# EAGLE design control (EAGLE 6.2)
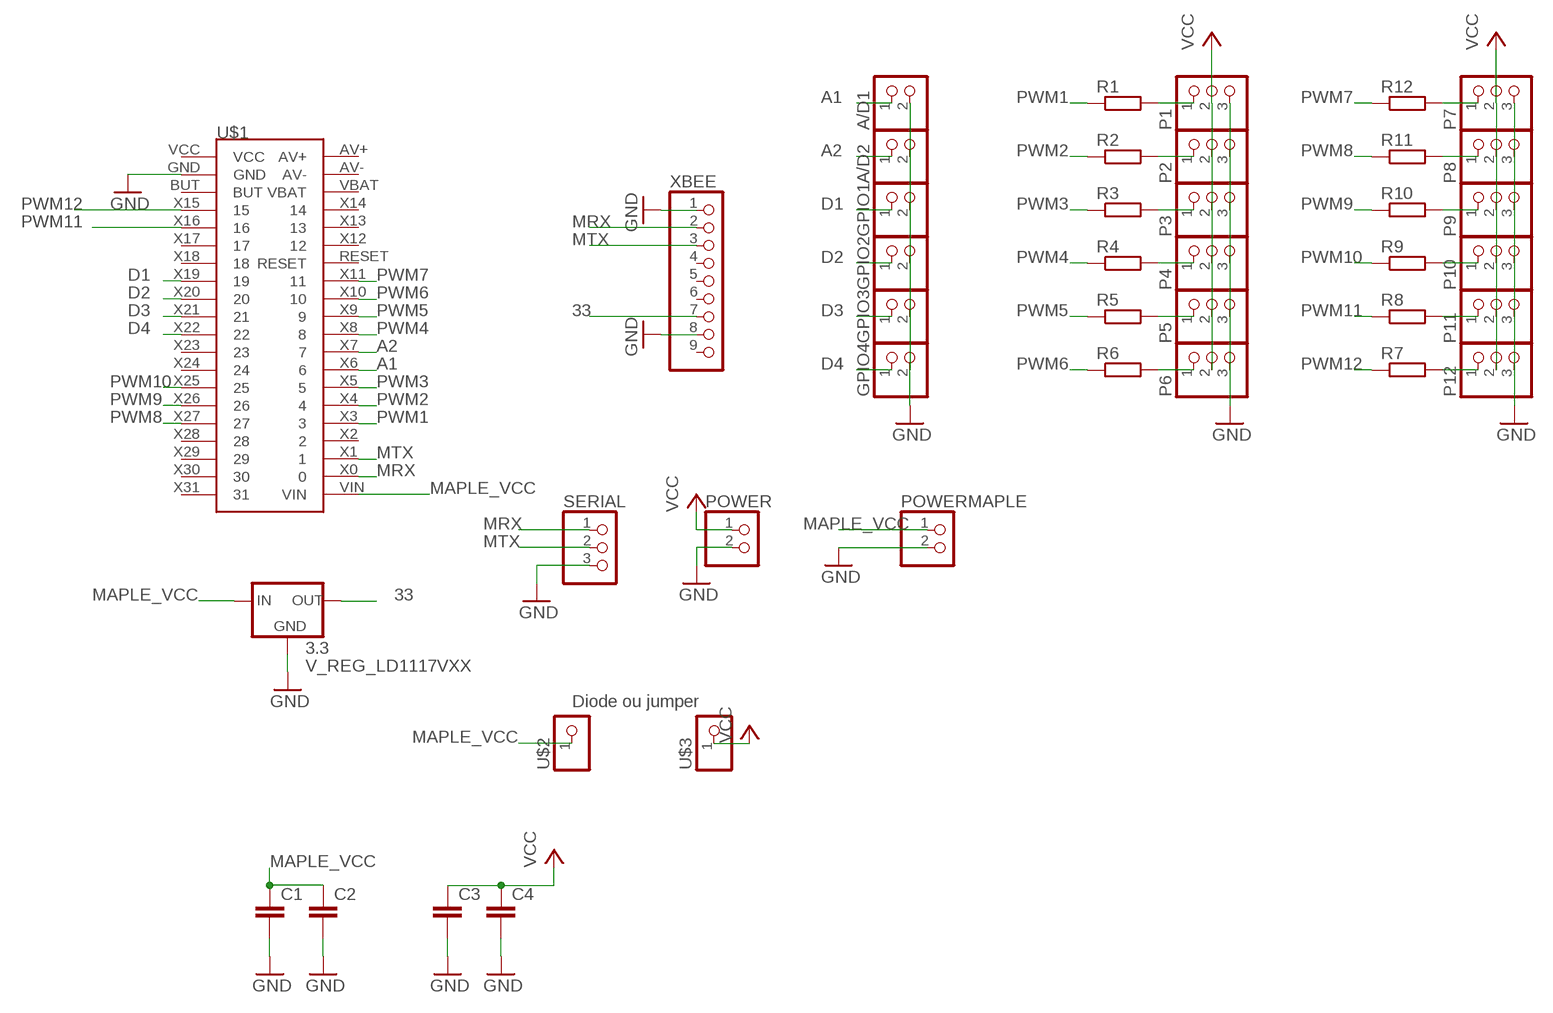
[diagram p0: schematic, sheet 1]

## Parts
3.3  V_REG_LD1117VXX  [78XXL]
A/D1  CONNEC_1X02  [CONNEC_1X02]
A/D2  CONNEC_1X02  [CONNEC_1X02]
C1  C-EU075-032X103  [C075-032X103]
C2  C-EU075-032X103  [C075-032X103]
C3  C-EU075-032X103  [C075-032X103]
C4  C-EU075-032X103  [C075-032X103]
GPIO1  CONNEC_1X02  [CONNEC_1X02]
GPIO2  CONNEC_1X02  [CONNEC_1X02]
GPIO3  CONNEC_1X02  [CONNEC_1X02]
GPIO4  CONNEC_1X02  [CONNEC_1X02]
P1  CONNEC_1X03  [CONNEC_1X03]
P2  CONNEC_1X03  [CONNEC_1X03]
P3  CONNEC_1X03  [CONNEC_1X03]
P4  CONNEC_1X03  [CONNEC_1X03]
P5  CONNEC_1X03  [CONNEC_1X03]
P6  CONNEC_1X03  [CONNEC_1X03]
P7  CONNEC_1X03  [CONNEC_1X03]
P8  CONNEC_1X03  [CONNEC_1X03]
P9  CONNEC_1X03  [CONNEC_1X03]
P10  CONNEC_1X03  [CONNEC_1X03]
P11  CONNEC_1X03  [CONNEC_1X03]
P12  CONNEC_1X03  [CONNEC_1X03]
POWER  CONNEC_1X02  [CONNEC_1X02]
POWERMAPLE  CONNEC_1X02  [CONNEC_1X02]
R1  RESISTANCE-R0805  [R0805]
R2  RESISTANCE-R0805  [R0805]
R3  RESISTANCE-R0805  [R0805]
R4  RESISTANCE-R0805  [R0805]
R5  RESISTANCE-R0805  [R0805]
R6  RESISTANCE-R0805  [R0805]
R7  RESISTANCE-R0805  [R0805]
R8  RESISTANCE-R0805  [R0805]
R9  RESISTANCE-R0805  [R0805]
R10  RESISTANCE-R0805  [R0805]
R11  RESISTANCE-R0805  [R0805]
R12  RESISTANCE-R0805  [R0805]
SERIAL  CONNEC_1X03  [CONNEC_1X03]
U$1  MAPLE_MINI  [CONNEC_2X20]
U$2  CONNEC_1X01  [CONNEC_1X01]
U$3  CONNEC_1X01  [CONNEC_1X01]
XBEE  CONNEC_1X09  [CONNEC_1X09]

## Nets
33: 3.3.GND(OUT) XBEE.7
A1: A/D1.1 U$1.X6
A2: A/D2.1 U$1.X7
D1: GPIO1.1 U$1.X19
D2: GPIO2.1 U$1.X20
D3: GPIO3.1 U$1.X21
D4: GPIO4.1 U$1.X22
GND [alime]: 3.3.IN(GND) A/D1.2 A/D2.2 C1.2 C2.2 C3.2 C4.2 GPIO1.2 GPIO2.2 GPIO3.2 GPIO4.2 P1.3 P2.3 P3.3 P4.3 P5.3 P6.3 P7.3 P8.3 P9.3 P10.3 P11.3 P12.3 POWER.2 POWERMAPLE.2 SERIAL.3 U$1.GND XBEE.1 XBEE.8
MAPLE_VCC: 3.3.OUT(IN) C1.1 C2.1 POWERMAPLE.1 U$1.VIN U$2.1
MRX: SERIAL.1 U$1.X0 XBEE.2
MTX: SERIAL.2 U$1.X1 XBEE.3
N$1: P1.1 R1.2
N$2: P2.1 R2.2
N$3: P3.1 R3.2
N$4: P4.1 R4.2
N$5: P5.1 R5.2
N$6: P6.1 R6.2
N$7: P12.1 R7.2
N$8: P11.1 R8.2
N$9: P10.1 R9.2
N$10: P9.1 R10.2
N$11: P8.1 R11.2
N$12: P7.1 R12.2
PWM1: R1.1 U$1.X3
PWM2: R2.1 U$1.X4
PWM3: R3.1 U$1.X5
PWM4: R4.1 U$1.X8
PWM5: R5.1 U$1.X9
PWM6: R6.1 U$1.X10
PWM7: R12.1 U$1.X11
PWM8: R11.1 U$1.X27
PWM9: R10.1 U$1.X26
PWM10: R9.1 U$1.X25
PWM11: R8.1 U$1.X16
PWM12: R7.1 U$1.X15
VCC [alime]: C3.1 C4.1 P1.2 P2.2 P3.2 P4.2 P5.2 P6.2 P7.2 P8.2 P9.2 P10.2 P11.2 P12.2 POWER.1 U$3.1
Unconnected: U$1.AV+ U$1.AV- U$1.BUT U$1.RESET U$1.VBAT U$1.VCC U$1.X2 U$1.X12 U$1.X13 U$1.X14 U$1.X17 U$1.X18 U$1.X23 U$1.X24 U$1.X28 U$1.X29 U$1.X30 U$1.X31 XBEE.4 XBEE.5 XBEE.6 XBEE.9

## Notes on the sheet
- Diode ou jumper

## Library data of the parts
3.3 = SparkFun-PowerIC:V_REG_LD1117VXX: LD1117VXX voltage regulator. We carry the 3.3V version (COM-00526) in TO-220 package.
A/D1 A/D2 GPIO1-GPIO4 POWER POWERMAPLE = rhoban:CONNEC_1X02
C1-C4 = rcl:C-EU: CAPACITOR, European symbol
P1-P12 SERIAL = rhoban:CONNEC_1X03
R1-R12 = rhoban:RESISTANCE: RESISTOR, European symbol
U$1 = rhoban:MAPLE_MINI
U$2 U$3 = rhoban:CONNEC_1X01
XBEE = rhoban:CONNEC_1X09

## Net classes
1 alime: width 1.016 mm

## Board
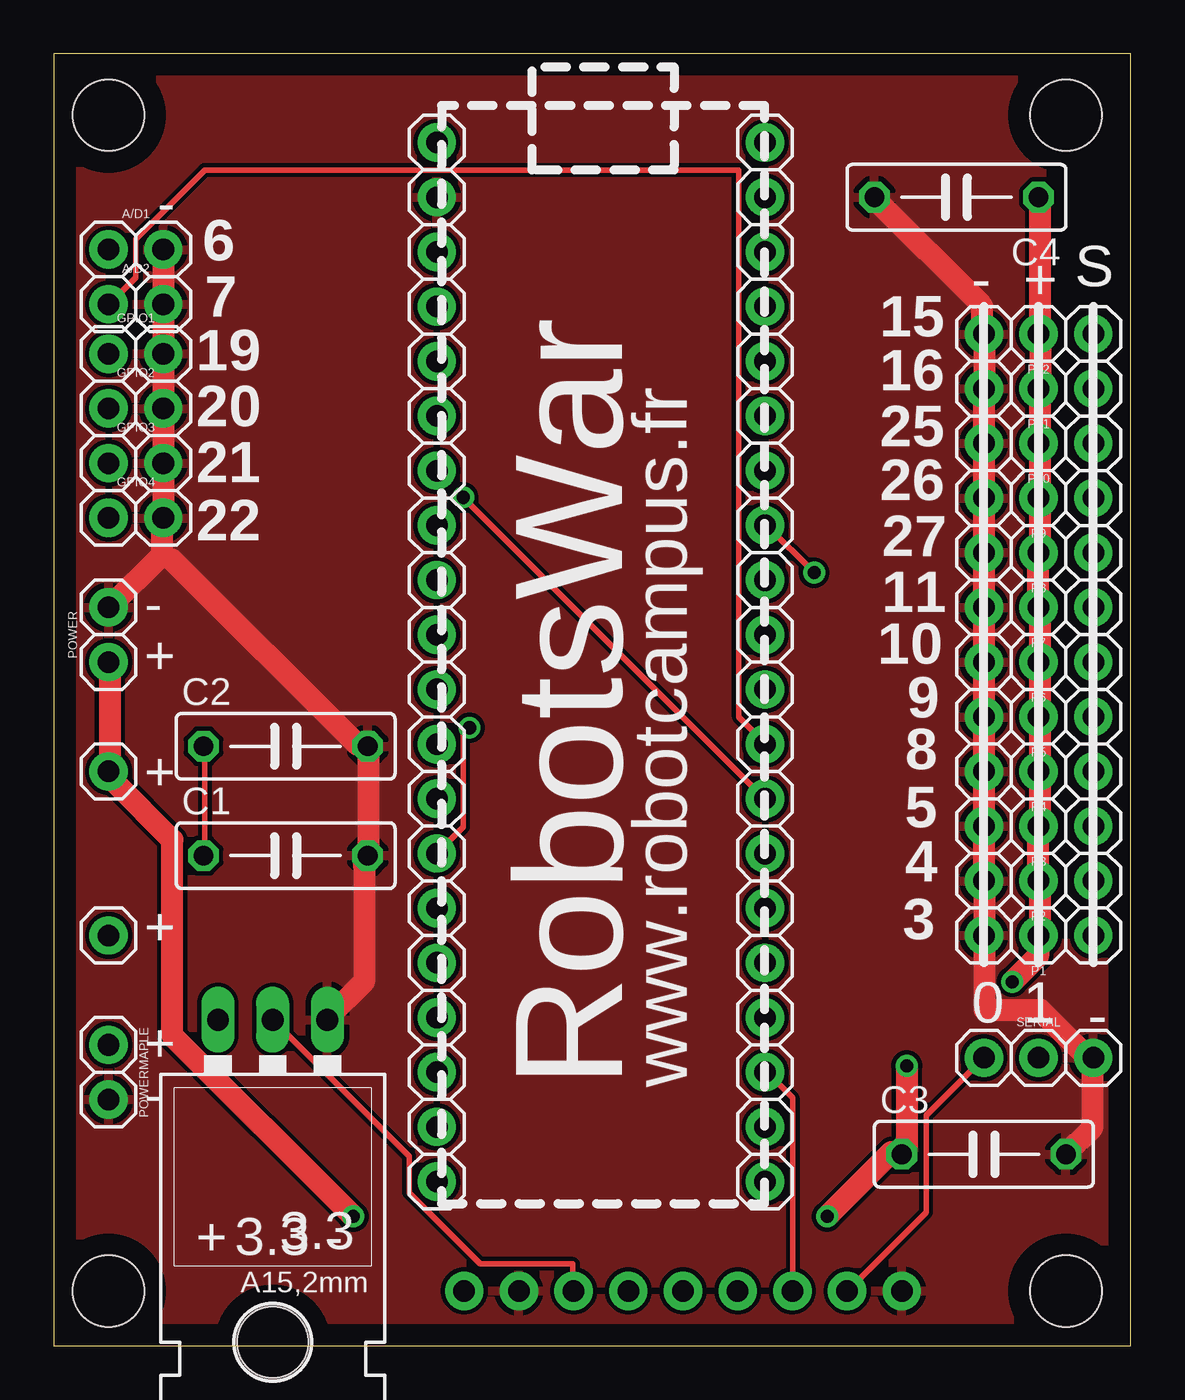
[diagram p1: board, top side]
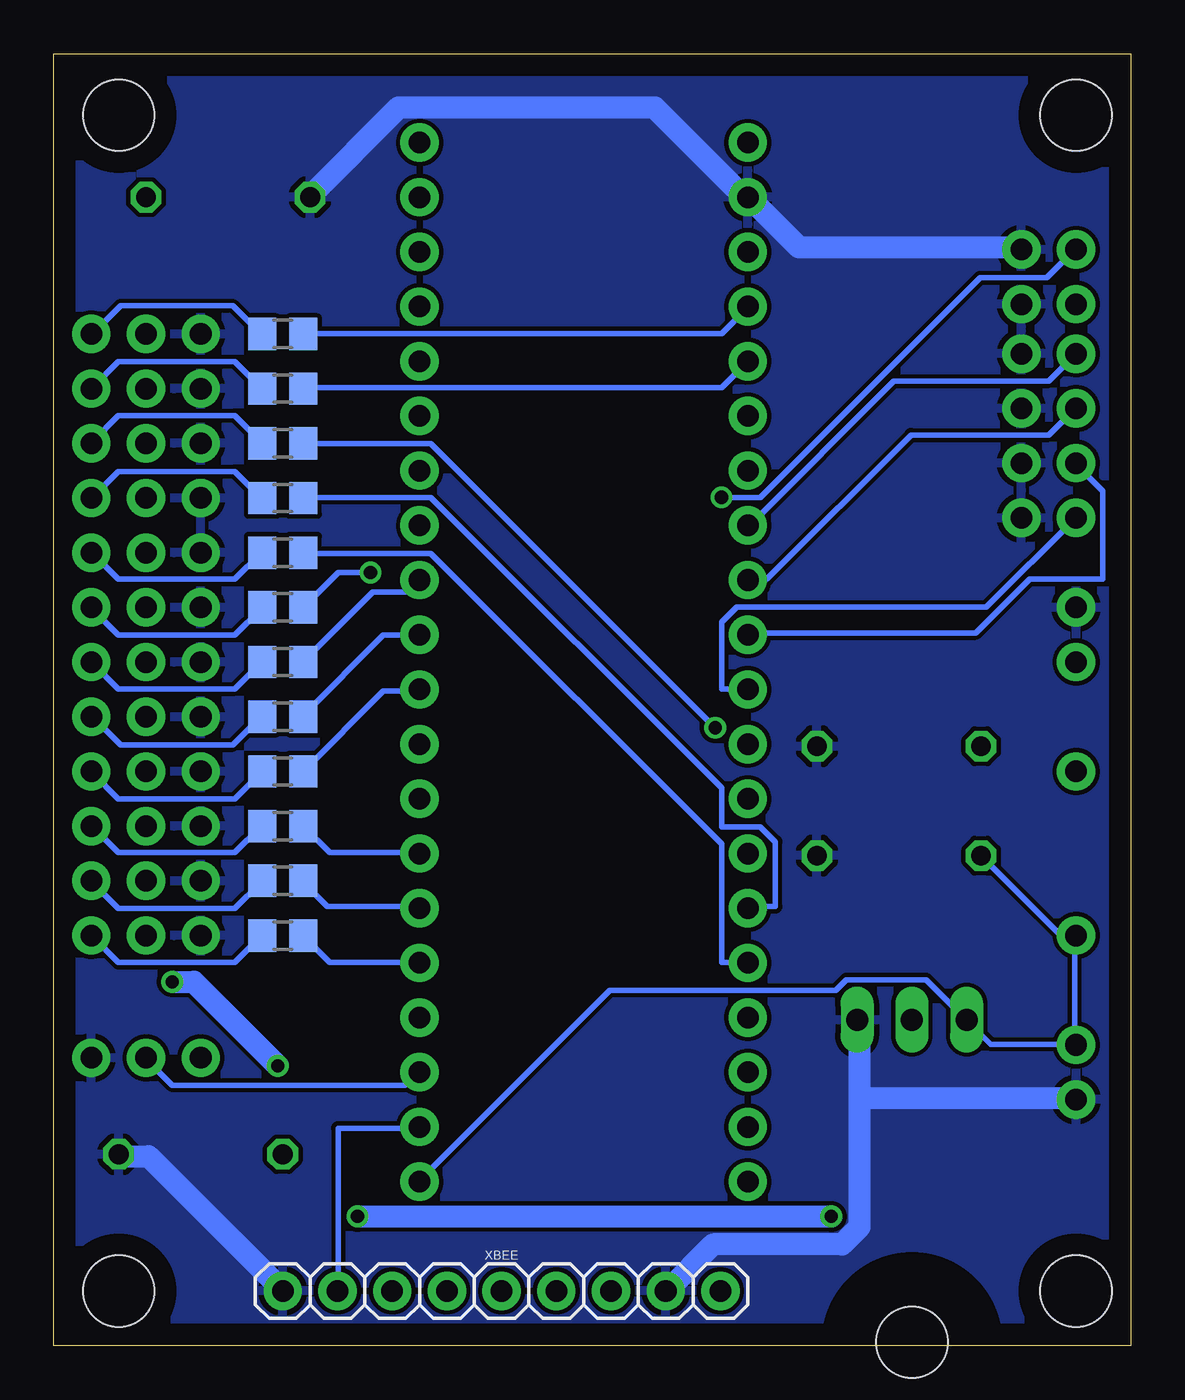
[diagram p2: board, bottom side, seen from below]

Size 50 x 60 mm. Coordinates in mm from the lower left corner, seen from the top.
Outline: 0,0 50,0 50,60 0,60 0,0
Copper layers (1*16): Top 0.035mm / dielectric 1.5mm / Bottom 0.035mm
Design rules: minimum track width 10mil, minimum drill 24mil, track to track 8mil, track to pad 8mil, pad to pad 8mil, via to via 8mil, smd to smd 8mil, copper to edge 40mil, drill to drill 8mil, minimum pad ring 10mil, minimum via ring 8mil, stop-mask expansion 4mil, vias tented up to drill 0mil, thermal gap 10mil

### Footprints (pad centres in the part's own frame; a part is rotated, then mirrored left to right if it is on the bottom)
78XXL = drill 1.016 long: GND 0,-3.81; IN -2.54,-3.81; OUT 2.54,-3.81 | hole 3.302: 0,11.176
CONNEC_1X02 = drill 1 pad 1.778: 1 -1.27,1.27; 2 1.27,1.27
C075-032X103 = drill 0.914 octagon: 1 -3.81,0; 2 3.81,0
CONNEC_1X03 = drill 1 pad 1.778: 1 -1.27,1.27; 2 1.27,1.27; 3 3.81,1.27
R0805 = smd 1.3 x 1.5: 1 -0.95,0; 2 0.95,0
CONNEC_2X20 = drill 1 pad 1.778: AV+ 0,0; AV- 2.54,0; BUT 5.08,-15.24; GND 2.54,-15.24; RESET 15.24,0; VBAT 5.08,0; VCC 0,-15.24; VIN 48.26,0; X0 45.72,0; X1 43.18,0; X2 40.64,0; X3 38.1,0; X4 35.56,0; X5 33.02,0; X6 30.48,0; X7 27.94,0; X8 25.4,0; X9 22.86,0; X10 20.32,0; X11 17.78,0; X12 12.7,0; X13 10.16,0; X14 7.62,0; X15 7.62,-15.24; X16 10.16,-15.24; X17 12.7,-15.24; X18 15.24,-15.24; X19 17.78,-15.24; X20 20.32,-15.24; X21 22.86,-15.24; X22 25.4,-15.24; X23 27.94,-15.24; X24 30.48,-15.24; X25 33.02,-15.24; X26 35.56,-15.24; X27 38.1,-15.24; X28 40.64,-15.24; X29 43.18,-15.24; X30 45.72,-15.24; X31 48.26,-15.24
CONNEC_1X01 = drill 1 pad 1.778: 1 0,0
STAND-OFF = hole 3.302: 0,0
CONNEC_1X09 = drill 1 pad 1.778: 1 -1.27,1.27; 2 1.27,1.27; 3 3.81,1.27; 4 6.35,1.27; 5 8.89,1.27; 6 11.43,1.27; 7 13.97,1.27; 8 16.51,1.27; 9 19.05,1.27

### Placement (x,y rotation side)
3.3  10.16,11.33 180 top
A/D1  3.81,49.64 0 top
A/D2  3.81,47.1 0 top
C1  10.76,22.76 0 top
C2  10.76,27.84 0 top
C3  43.18,8.89 0 top
C4  41.91,53.34 180 top
GPIO1  3.81,44.8 0 top
GPIO2  3.81,42.26 0 top
GPIO3  3.81,39.72 0 top
GPIO4  3.81,37.18 0 top
P1  46.99,20.32 180 top
P2  46.99,22.86 180 top
P3  46.99,25.4 180 top
P4  46.99,27.94 180 top
P5  46.99,30.48 180 top
P6  46.99,33.02 180 top
P7  46.99,35.56 180 top
P8  46.99,38.1 180 top
P9  46.99,40.64 180 top
P10  46.99,43.18 180 top
P11  46.99,45.72 180 top
P12  46.99,48.26 180 top
POWER  3.81,33.02 90 top
POWERMAPLE  1.27,12.7 270 top
R1  39.37,19.05 180 bottom
R2  39.37,21.59 180 bottom
R3  39.37,24.13 180 bottom
R4  39.37,26.67 180 bottom
R5  39.37,29.21 180 bottom
R6  39.37,31.75 180 bottom
R7  39.37,46.99 180 bottom
R8  39.37,44.45 180 bottom
R9  39.37,41.91 180 bottom
R10  39.37,39.37 180 bottom
R11  39.37,36.83 180 bottom
R12  39.37,34.29 180 bottom
SERIAL  44.45,12.1 0 top
U$1  33.02,55.88 270 top
U$2  2.54,19.05 0 top
U$3  2.54,26.67 0 top
U$4  [STAND-OFF]  2.54,57.15 0 top
U$5  [STAND-OFF]  2.54,2.54 0 top
U$6  [STAND-OFF]  46.99,2.54 0 top
U$7  [STAND-OFF]  46.99,57.15 0 top
XBEE  38.1,1.27 0 bottom

### Tracks (layer width: path | path; a pad name or v marks a point on that pad's centre or on a via)
33
  Top 0.254: 3.3.GND 16.5,8.8 16.5,7.1 19.8,3.8 24.1,3.8 24.1,2.6 XBEE.7
A1  (via drill 0.61)
  Top 0.254: v19,39.4 33,25.4 U$1.X6
  Bottom 0.254: v19,39.4 17.2,39.4 7,49.6 3.9,49.6 2.6,50.9 A/D1.1
A2
  Top 0.254: A/D2.1 2.6,48.4 3.8,49.6 3.8,51.4 7,54.6 31.8,54.6 31.8,29.2 33,28 U$1.X7
D1
  Bottom 0.254: GPIO1.1 2.6,46 3.8,44.8 11,44.8 17.7,38.1 U$1.X19
D2
  Bottom 0.254: GPIO2.1 2.6,43.5 3.8,42.3 10.2,42.3 16.9,35.6 17.7,35.6 U$1.X20
D3
  Bottom 0.254: GPIO3.1 2.5,40.9 1.3,39.7 1.3,35.6 4.7,35.6 7.2,33.1 17.7,33.1 U$1.X21
D4
  Bottom 0.254: GPIO4.1 2.6,38.4 6.7,34.3 18.3,34.3 19,33.6 19,30.5 17.8,30.5 U$1.X22
GND
  Top 1.016: C3.2 48.2,10.1 48.2,13.3 SERIAL.3 47.8,13.6 45.8,15.6 43.2,15.6 43.2,18.6 P1.3 43.2,19.1 43.2,21.5 P2.3 43.2,22.1 43.2,24.1 P3.3 43.2,24.6 43.2,26.6 P4.3 43.2,27.2 43.2,29.2 P5.3 43.2,29.7 43.2,31.7 P6.3 43.2,32.2 43.2,34.2 P7.3 43.2,34.8 43.2,36.8 P8.3 43.2,37.3 43.2,39.3 P9.3 43.2,39.9 43.2,41.9 P10.3 43.2,42.4 43.2,44 P11.3 43.2,44.5 43.2,46.5 P12.3 43.1,47 43.1,48.3 38.1,53.3 C4.2 | 5,36.7 2.6,34.3 POWER.2 | 5,36.7 5,38.4 GPIO4.2 5.1,38.9 5.1,40.9 GPIO3.2 5.1,41.5 5.1,43.5 GPIO2.2 5.1,44 5.1,46 GPIO1.2 5.1,46.6 5.1,48.3 A/D2.2 5.1,48.9 5.1,50.9 A/D1.2 | 3.3.IN 12.7,15.2 14.4,16.9 14.4,22.3 C1.2 14.6,22.8 14.6,27.8 C2.2 14.1,27.9 5.5,36.5 5,36.7
  Bottom 1.016: XBEE.1 39.4,2.6 45.6,8.8 46.9,8.8 C3.2 | A/D1.2 5.1,51 15.4,51 17.7,53.3 U$1.GND 18.2,53.6 22.1,57.5 34,57.5 38.1,53.4 C4.2 | 12.6,11.5 12.6,15.1 12.7,15.1 3.3.IN | 12.6,11.5 12.6,5.5 13.4,4.7 19.4,4.7 21.5,2.6 XBEE.8 | 12.6,11.5 2.6,11.5 POWERMAPLE.2
  pour Top: 0,60 49.8,60 49.8,0 0,0 0,59.4
  pour Bottom: 0,60 49.8,60 49.8,0 0,0 0,59.4
MAPLE_VCC
  Top 0.254: C1.1 7,22.8 7,27.8 C2.1
  Bottom 0.254: U$1.VIN 33,7.7 24.2,16.5 13.7,16.5 13.2,17 9.5,17 7.7,15.2 3.3.OUT 7.6,15.1 6.5,14 2.6,14 POWERMAPLE.1 2.6,14.1 2.6,19 U$2.1 2.7,19 3.2,19 6.9,22.7 C1.1
MRX
  Top 0.254: SERIAL.1 43.1,13.3 40.5,10.7 40.5,6.2 36.9,2.6 XBEE.2
  Bottom 0.254: XBEE.2 36.8,2.6 36.8,10.1 33.1,10.1 U$1.X0
MTX
  Top 0.254: XBEE.3 34.3,2.6 34.3,11.5 33.1,12.7 U$1.X1
  Bottom 0.254: SERIAL.2 45.7,13.3 44.5,12.1 33.7,12.1 33.1,12.7 U$1.X1
N$1
  Bottom 0.254: R1.2 40.4,19 41.6,17.8 47,17.8 48.2,19 P1.1
N$2
  Bottom 0.254: R2.2 40.4,21.5 41.6,20.3 47,20.3 48.2,21.5 P2.1
N$3
  Bottom 0.254: R3.2 40.4,24.1 41.6,22.9 47,22.9 48.2,24.1 P3.1
N$4
  Bottom 0.254: R4.2 40.4,26.6 41.6,25.4 47,25.4 48.2,26.6 P4.1
N$5
  Bottom 0.254: R5.2 40.4,29.2 41.7,27.9 46.9,27.9 48.2,29.2 P5.1
N$6
  Bottom 0.254: R6.2 40.4,31.7 41.6,30.5 47,30.5 48.2,31.7 P6.1
N$7
  Bottom 0.254: R7.2 40.4,47 41.7,48.3 46.9,48.3 48.2,47 P12.1
N$8
  Bottom 0.254: R8.2 40.4,44.5 41.6,45.7 47,45.7 48.2,44.5 P11.1
N$9
  Bottom 0.254: R9.2 40.4,42 41.6,43.2 47,43.2 48.2,42 P10.1
N$10
  Bottom 0.254: R10.2 40.4,39.4 41.6,40.6 47,40.6 48.2,39.4 P9.1
N$11
  Bottom 0.254: R11.2 40.4,36.8 41.6,35.6 47,35.6 48.2,36.8 P8.1
N$12
  Bottom 0.254: R12.2 40.4,34.2 41.6,33 47,33 48.2,34.2 P7.1
PWM1
  Bottom 0.254: R1.1 38.4,19 37.2,17.8 33.1,17.8 U$1.X3
PWM2
  Bottom 0.254: R2.1 38.4,21.5 37.3,20.4 33.1,20.4 U$1.X4
PWM3
  Bottom 0.254: R3.1 38.4,24.1 37.2,22.9 33.1,22.9 U$1.X5
PWM4
  Bottom 0.254: R4.1 38.4,26.7 34.7,30.4 33.1,30.4 U$1.X8
PWM5
  Bottom 0.254: R5.1 38.4,29.3 34.7,33 33.1,33 U$1.X9
PWM6
  Bottom 0.254: R6.1 38.4,31.8 35.2,35 33.6,35 33.1,35.5 U$1.X10
PWM7  (via drill 0.61)
  Top 0.254: v35.3,35.9 33.1,38.1 U$1.X11
  Bottom 0.254: v35.3,35.9 36.8,35.9 38.4,34.3 R12.1
PWM8
  Bottom 0.254: R11.1 38.4,36.8 32.5,36.8 19,23.3 19,17.8 17.8,17.8 U$1.X27
PWM9
  Bottom 0.254: R10.1 38.4,39.4 32.5,39.4 19,25.9 19,24.1 17.2,24.1 16.5,23.4 16.5,20.4 17.7,20.4 U$1.X26
PWM10  (via drill 0.61)
  Top 0.254: v19.3,28.7 19,28.4 19,24.1 17.8,22.9 U$1.X25
  Bottom 0.254: v19.3,28.7 32.5,41.9 38.4,41.9 R9.1
PWM11
  Bottom 0.254: U$1.X16 19,44.5 38.4,44.5 R8.1
PWM12
  Bottom 0.254: R7.1 38.4,47 19,47 17.8,48.2 U$1.X15
VCC  (via drill 0.61)
  Top 1.016: C4.1 45.8,53.3 45.8,47 P12.2 45.8,46.5 45.8,44.5 P11.2 45.8,44 45.8,42.4 P10.2 45.8,41.9 45.8,39.8 P9.2 45.8,39.3 45.8,37.3 P8.2 45.7,36.8 45.7,34.8 P7.2 45.8,34.2 45.8,32.2 P6.2 45.8,31.7 45.8,29.7 P5.2 45.8,29.2 45.8,27.1 P4.2 45.8,26.6 45.8,24.6 P3.2 45.7,24.1 45.7,22.1 P2.2 45.8,21.5 45.8,19.5 P1.2 45.7,19 45.7,18.1 v44.5,16.9 | POWER.1 2.6,31.7 2.6,26.7 U$3.1 2.8,26.2 5.5,23.5 5.5,14.4 v13.9,6 | v39.6,13 39.6,9.1 39.4,8.9 C3.1 38.9,9 v35.9,6
  Bottom 1.016: v39.6,13 43.5,16.9 v44.5,16.9 | v35.9,6 v13.9,6

### Text on the board
tPlace: - | 6 | - | + | S | 7 | 15 | 19 | 16 | 20 | 25 | 21 | 26 | 22 | 27 | - | 11 | 10 | + | 9 | 8 | + | 5 | 4 | + | 3 | 0 | 1 | - | + | RobotsWar | www.robotcampus.fr | - | + | 3.3 | -